# Altium project Altium.PrjPcb
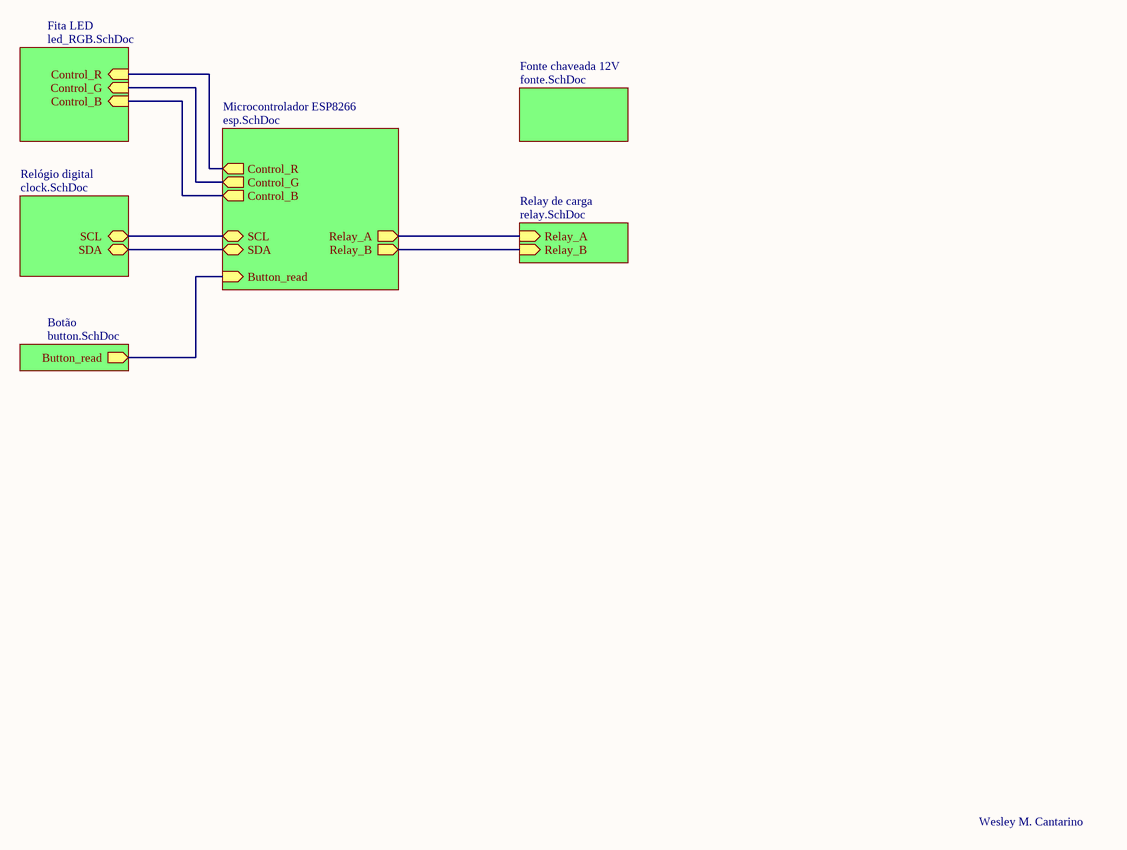
[diagram p0: main.SchDoc]
7 sheets, 38 parts. Net scope: hierarchical (ports join the sheet entries above them; power ports are global).
Board files: PCB_fonte_beta.PcbDoc, PCB1.PcbDoc, PCB2.PcbDoc
Sheets:
  main.SchDoc
    Microcontrolador ESP8266 = esp.SchDoc
    Fita LED = led_RGB.SchDoc
    Botão = button.SchDoc
    Relógio digital = clock.SchDoc
    Relay de carga = relay.SchDoc
    Fonte chaveada 12V = fonte.SchDoc

## Sheet main.SchDoc
size A4

### Sub-sheets
Botão = button.SchDoc: Button_read (out)
Fita LED = led_RGB.SchDoc: Control_R (in), Control_G (in), Control_B (in)
Fonte chaveada 12V = fonte.SchDoc: no entries
Microcontrolador ESP8266 = esp.SchDoc: Control_R (out), Control_G (out), Control_B (out), Button_read (in), SCL (bidir), SDA (bidir), Relay_B (out), Relay_A (out)
Relay de carga = relay.SchDoc: Relay_A (in), Relay_B (in)
Relógio digital = clock.SchDoc: SDA (bidir), SCL (bidir)

### Nets
Net*1_A: sheet Microcontrolador ESP8266/Button_read, sheet Botão/Button_read
NetClock1_3: sheet Microcontrolador ESP8266/SCL, sheet Relógio digital/SCL
NetClock1_4: sheet Microcontrolador ESP8266/SDA, sheet Relógio digital/SDA
NetNodeMCU_21: sheet Microcontrolador ESP8266/Control_B, sheet Fita LED/Control_B
NetNodeMCU_22: sheet Microcontrolador ESP8266/Control_G, sheet Fita LED/Control_G
NetNodeMCU_23: sheet Microcontrolador ESP8266/Control_R, sheet Fita LED/Control_R
NetNodeMCU_26: sheet Microcontrolador ESP8266/Relay_B, sheet Relay de carga/Relay_B
NetNodeMCU_27: sheet Microcontrolador ESP8266/Relay_A, sheet Relay de carga/Relay_A

### Notes on the sheet
- Wesley M. Cantarino

## Sheet esp.SchDoc
size A4
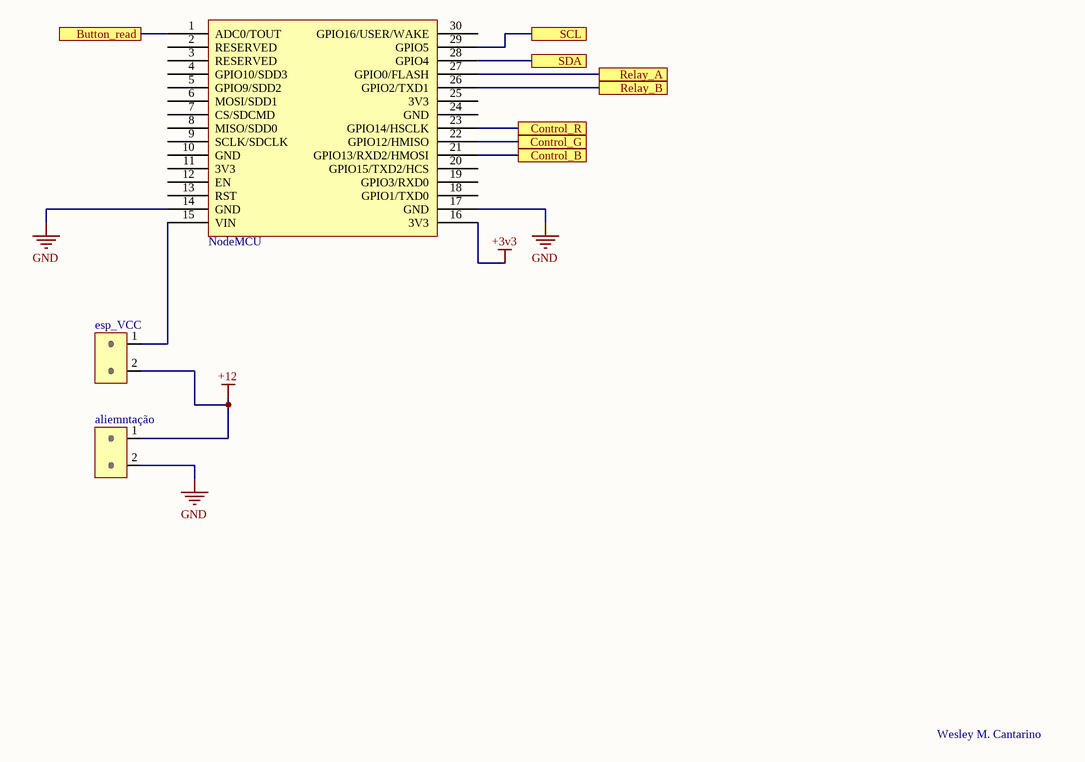
[diagram p1: esp.SchDoc]

### Parts
aliemntação  ?  [CN_KRE_2]  (value not drawn)
esp_VCC  ?  [HEADER_1X2]  (value not drawn)
NodeMCU  ESP8266 Development kit  [DIV_NodeMCU_Socket]  (value not drawn)

### Ports
Button_read, Control_B, Control_G, Control_R, Relay_A, Relay_B, SCL, SDA

### Nets
+3v3: NodeMCU.16(3V3)
+12: aliemntação.1 esp_VCC.2
GND: aliemntação.2 NodeMCU.14(GND) NodeMCU.17(GND)
Net*1_A: NodeMCU.1(ADC0/TOUT) ; port Button_read
NetClock1_3: NodeMCU.29(GPIO5) ; port SCL
NetClock1_4: NodeMCU.28(GPIO4) ; port SDA
Netesp_VCC_1: esp_VCC.1 NodeMCU.15(VIN)
NetNodeMCU_21: NodeMCU.21(GPIO13/RXD2/HMOSI) ; port Control_B
NetNodeMCU_22: NodeMCU.22(GPIO12/HMISO) ; port Control_G
NetNodeMCU_23: NodeMCU.23(GPIO14/HSCLK) ; port Control_R
NetNodeMCU_26: NodeMCU.26(GPIO2/TXD1) ; port Relay_B
NetNodeMCU_27: NodeMCU.27(GPIO0/FLASH) ; port Relay_A

Not connected (* = marked no-connect by the designer): NodeMCU 2(RESERVED) 3(RESERVED) 4(GPIO10/SDD3) 5(GPIO9/SDD2) 6(MOSI/SDD1) 7(CS/SDCMD) 8(MISO/SDD0) 9(SCLK/SDCLK) 10(GND) 11(3V3) 12(EN) 13(RST) 18(GPIO1/TXD0) 19(GPIO3/RXD0) 20(GPIO15/TXD2/HCS) 24(GND) 25(3V3) 30(GPIO16/USER/WAKE)

### Notes on the sheet
- Wesley M. Cantarino

### Library data of the parts
aliemntação esp_VCC = CN_MKDS_2: MKDS_2; Value: ?
NodeMCU = NodeMCU: Reference: https://bennthomsen.files.wordpress.com/2015/12/nodemcu_pinout_700-2.png; Schematic: https://raw.githubusercontent.com/nodemcu/nodemcu-devkit/master/Documents/NODEMCU_DEVKIT_SCH.png

## Sheet led_RGB.SchDoc
size A4
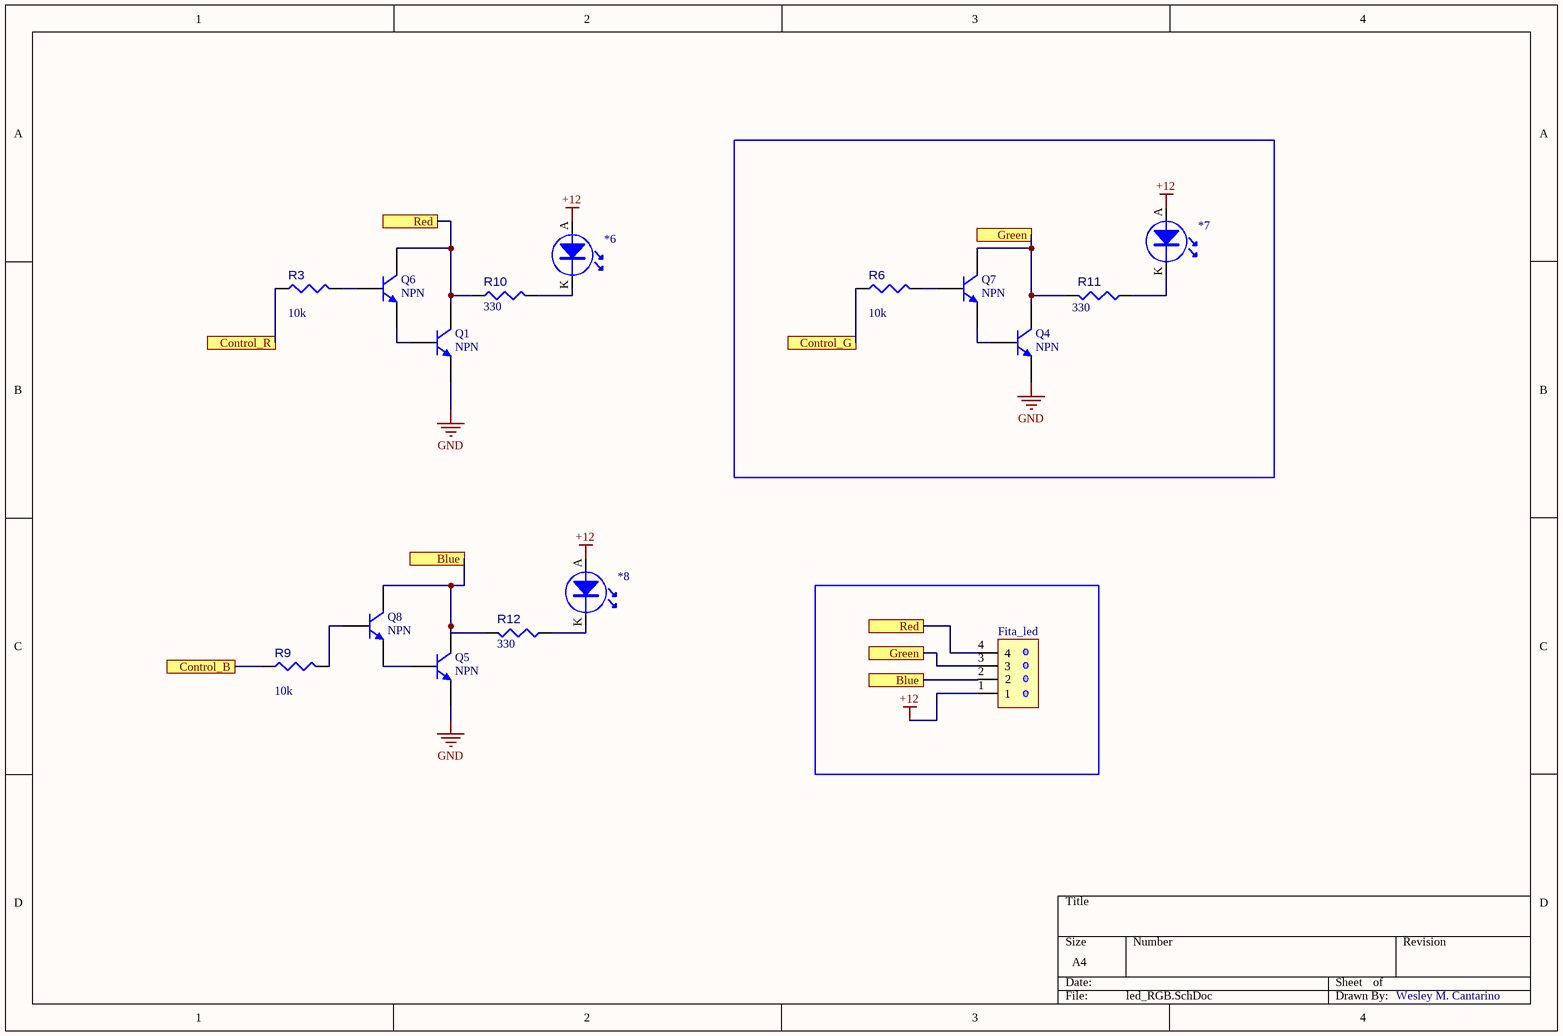
[diagram p2: led_RGB.SchDoc]

### Parts
*6  LED_AXIAL_5MM  [HEADER_1X2]  (value not drawn)
*7  LED_AXIAL_5MM  [HEADER_1X2]  (value not drawn)
*8  LED_AXIAL_5MM  [HEADER_1X2]  (value not drawn)
Fita_led  CN_KK_4  [CN_KK_4_5045-4]  (value not drawn)
Q1  NPN  [HEADER_1X3]
Q4  NPN  [HEADER_1X3]
Q5  NPN  [HEADER_1X3]
Q6  NPN  [HEADER_1X3]
Q7  NPN  [HEADER_1X3]
Q8  NPN  [HEADER_1X3]
R3  10k  [RES_PTH_7.62MM]
R6  10k  [RES_PTH_7.62MM]
R9  10k  [RES_PTH_7.62MM]
R10  330  [RES_PTH_7.62MM]
R11  330  [RES_PTH_7.62MM]
R12  330  [RES_PTH_7.62MM]

### Ports
Blue, Control_B, Control_G, Control_R, Green, Red

### Nets
+12: *6.A *7.A *8.A Fita_led.1
GND: Q1.3(E) Q4.3(E) Q5.3(E)
Net*6_K: *6.K R10.2
Net*7_K: *7.K R11.1
Net*8_K: *8.K R12.1
NetFita_led_2: Fita_led.2 Q5.1(C) Q8.1(C) R12.2 ; port Blue
NetFita_led_3: Fita_led.3 Q4.1(C) Q7.1(C) R11.2 ; port Green
NetFita_led_4: Fita_led.4 Q1.1(C) Q6.1(C) R10.1 ; port Red
NetNodeMCU_21: R9.1 ; port Control_B
NetNodeMCU_22: R6.1 ; port Control_G
NetNodeMCU_23: R3.1 ; port Control_R
NetQ1_2: Q1.2(B) Q6.3(E)
NetQ4_2: Q4.2(B) Q7.3(E)
NetQ5_2: Q5.2(B) Q8.3(E)
NetQ6_2: Q6.2(B) R3.2
NetQ7_2: Q7.2(B) R6.2
NetQ8_2: Q8.2(B) R9.2

### Notes on the sheet
- Wesley M. Cantarino

### Library data of the parts
*6-*8 = LED_AXIAL_5MM: pin to pad: A>1 K>2; Value: ?
Fita_led = CN_KK_4: KK_4; Value: ?
Q1 Q4-Q8 = NPN: NPN Bipolar Transistor; pin to pad: 1>2 2>1; Published: 8-Jun-2000; LatestRevisionDate: 17-Jul-2002; LatestRevisionNote: Re-released for DXP Platform.; PackageReference: TO-226-AA; Publisher: Altium Limited; PackageDescription: TO, Flat Index; 3 In-Line, Axial Leads; Body Dia. 4.8mm; Leads 0.55 x 0.51 mm (max); Code_JEDEC: TO-226-AA
R3 R6 R9-R12 = RES_PTH_7.62MM: Pin Through Hole Resistor 7.62mm
  R3 R6 R9: Value: 10k
  R10-R12: Value: 330

## Sheet button.SchDoc
size A4
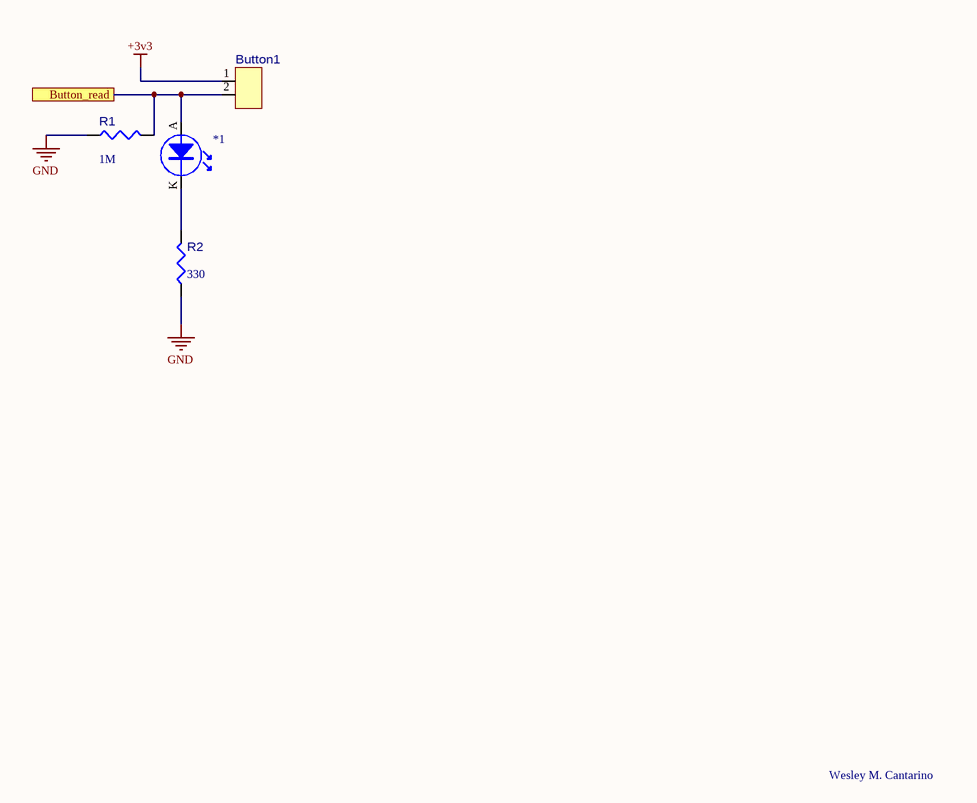
[diagram p3: button.SchDoc]

### Parts
*1  LED_AXIAL_5MM  [HEADER_1X2]  (value not drawn)
Button1  ?  [HEADER_1X2]  (value not drawn)
R1  1M  [RES_PTH_7.62MM]
R2  value 330  [RES_PTH_7.62MM]

### Ports
Button_read

### Nets
+3v3: Button1.1
GND: R1.1 R2.1
Net*1_A: *1.A Button1.2 R1.2 ; port Button_read
Net*1_K: *1.K R2.2

### Notes on the sheet
- Wesley M. Cantarino

### Library data of the parts
*1 = LED_AXIAL_5MM: pin to pad: A>1 K>2; Value: ?
Button1 = HEADER_1X2: 1X2; Value: ?
R1 R2 = RES_PTH_7.62MM: Pin Through Hole Resistor 7.62mm
  R1: Value: 1M

## Sheet clock.SchDoc
size A4
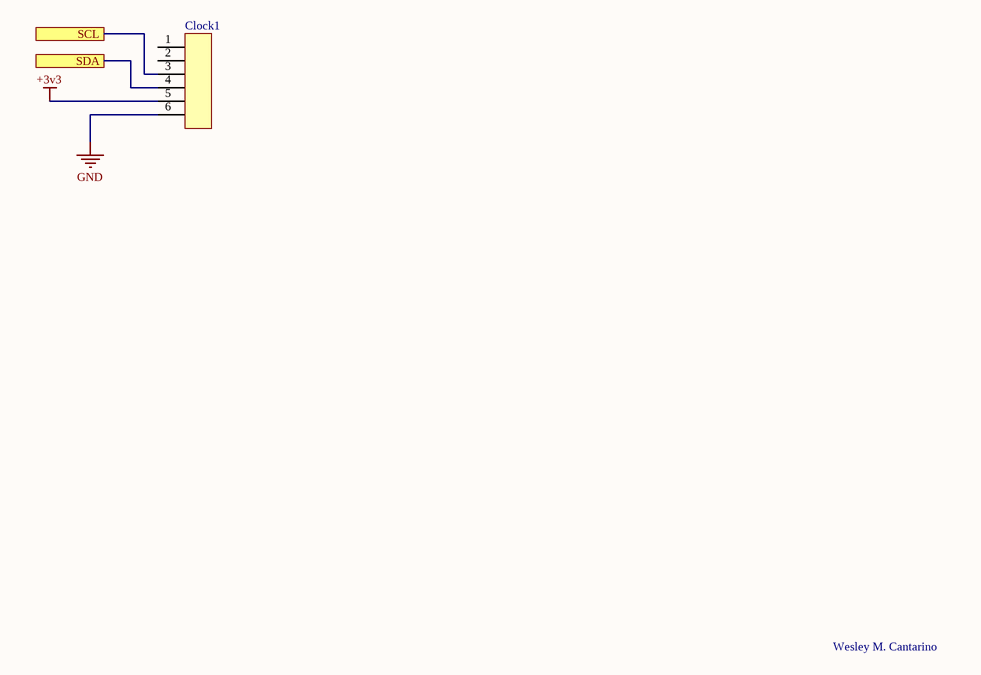
[diagram p4: clock.SchDoc]

### Parts
Clock1  HEADER_1X6  [HEADER_1X6]  (value not drawn)

### Ports
SCL, SDA

### Nets
+3v3: Clock1.5
GND: Clock1.6
NetClock1_3: Clock1.3 ; port SCL
NetClock1_4: Clock1.4 ; port SDA

Not connected (* = marked no-connect by the designer): Clock1 1 2

### Notes on the sheet
- Wesley M. Cantarino

### Library data of the parts
Clock1 = HEADER_1X6: 1X6; Value: ?

## Sheet relay.SchDoc
size A4
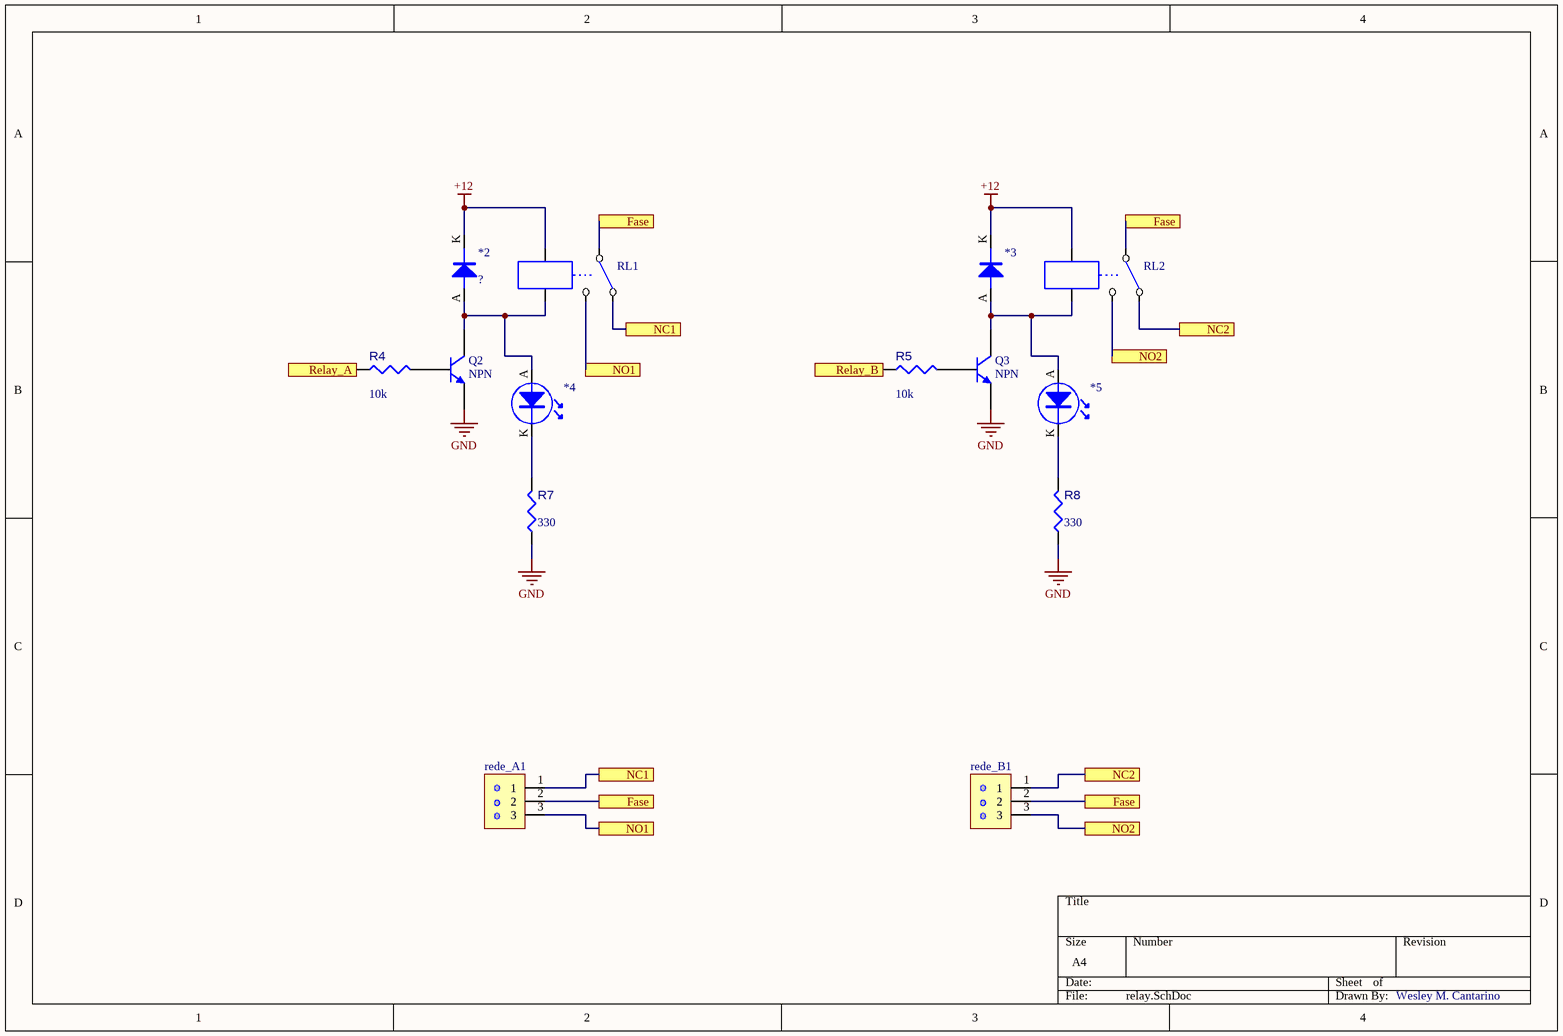
[diagram p5: relay.SchDoc]

### Parts
*2  DIO_PTH_1N4007  [DIO_PTH_DO41]  (value not drawn)
*3  DIO_PTH_1N4007  [DIO_PTH_DO41]  (value not drawn)
*4  LED_AXIAL_5MM  [HEADER_1X2]  (value not drawn)
*5  LED_AXIAL_5MM  [HEADER_1X2]  (value not drawn)
Q2  NPN  [HEADER_1X3]
Q3  NPN  [HEADER_1X3]
R4  10k  [RES_PTH_7.62MM]
R5  10k  [RES_PTH_7.62MM]
R7  330  [RES_PTH_7.62MM]
R8  330  [RES_PTH_7.62MM]
rede_A1  ?  [CN_KRE_3]  (value not drawn)
rede_B1  ?  [CN_KRE_3]  (value not drawn)
RL1  RELEICR5551  [DIV_RELE_5551]  (value not drawn)
RL2  RELEICR5551  [DIV_RELE_5551]  (value not drawn)

### Ports
Fase, NC1, NC2, NO1, NO2, Relay_A, Relay_B

### Nets
+12: *2.K *3.K RL1.4 RL2.4
GND: Q2.3(E) Q3.3(E) R7.1 R8.1
Net*2_A: *2.A *4.A Q2.1(C) RL1.5
Net*3_A: *3.A *5.A Q3.1(C) RL2.5
Net*4_K: *4.K R7.2
Net*5_K: *5.K R8.2
NetNodeMCU_26: R5.1 ; port Relay_B
NetNodeMCU_27: R4.1 ; port Relay_A
NetQ2_2: Q2.2(B) R4.2
NetQ3_2: Q3.2(B) R5.2
Netrede_A1_1: rede_A1.1 RL1.2 ; port NC1
Netrede_A1_2: rede_A1.2 rede_B1.2 RL1.1 RL2.1 ; port Fase
Netrede_A1_3: rede_A1.3 RL1.3 ; port NO1
Netrede_B1_1: rede_B1.1 RL2.2 ; port NC2
Netrede_B1_3: rede_B1.3 RL2.3 ; port NO2

### Notes on the sheet
- Wesley M. Cantarino

### Library data of the parts
*4 *5 = LED_AXIAL_5MM: pin to pad: A>1 K>2; Value: ?
Q2 Q3 = NPN: NPN Bipolar Transistor; Published: 8-Jun-2000; LatestRevisionDate: 17-Jul-2002; LatestRevisionNote: Re-released for DXP Platform.; PackageReference: TO-226-AA; Publisher: Altium Limited; PackageDescription: TO, Flat Index; 3 In-Line, Axial Leads; Body Dia. 4.8mm; Leads 0.55 x 0.51 mm (max); Code_JEDEC: TO-226-AA
R4 R5 R7 R8 = RES_PTH_7.62MM: Pin Through Hole Resistor 7.62mm
  R4 R5: Value: 10k
  R7 R8: Value: 330
rede_A1 rede_B1 = CN_MKDS_3: MKDS_3; Value: ?
*2 *3 = DIO_PTH_1N4007: Value: ?
RL1 RL2 = RELEICR5551: Value: RELEICR5551

## Sheet fonte.SchDoc
size A4
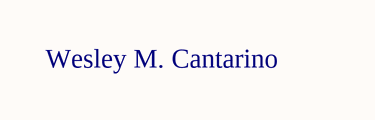
[diagram p6: fonte.SchDoc]

### Notes on the sheet
- Wesley M. Cantarino

## Nets that join several sheets
+3v3: esp (NodeMCU.16), button (Button1.1), clock (Clock1.5)
+12: esp (aliemntação.1 esp_VCC.2), led_RGB (*6.A *7.A *8.A Fita_led.1), relay (*2.K *3.K RL1.4 RL2.4)
GND: esp (aliemntação.2 NodeMCU.14 NodeMCU.17), led_RGB (Q1.3 Q4.3 Q5.3), button (R1.1 R2.1), clock (Clock1.6), relay (Q2.3 Q3.3 R7.1 R8.1)
Net*1_A: esp (NodeMCU.1), button (*1.A Button1.2 R1.2)
NetClock1_3: esp (NodeMCU.29), clock (Clock1.3)
NetClock1_4: esp (NodeMCU.28), clock (Clock1.4)
NetNodeMCU_21: esp (NodeMCU.21), led_RGB (R9.1)
NetNodeMCU_22: esp (NodeMCU.22), led_RGB (R6.1)
NetNodeMCU_23: esp (NodeMCU.23), led_RGB (R3.1)
NetNodeMCU_26: esp (NodeMCU.26), relay (R5.1)
NetNodeMCU_27: esp (NodeMCU.27), relay (R4.1)